# EAGLE design sl811hs (EAGLE 4.16)
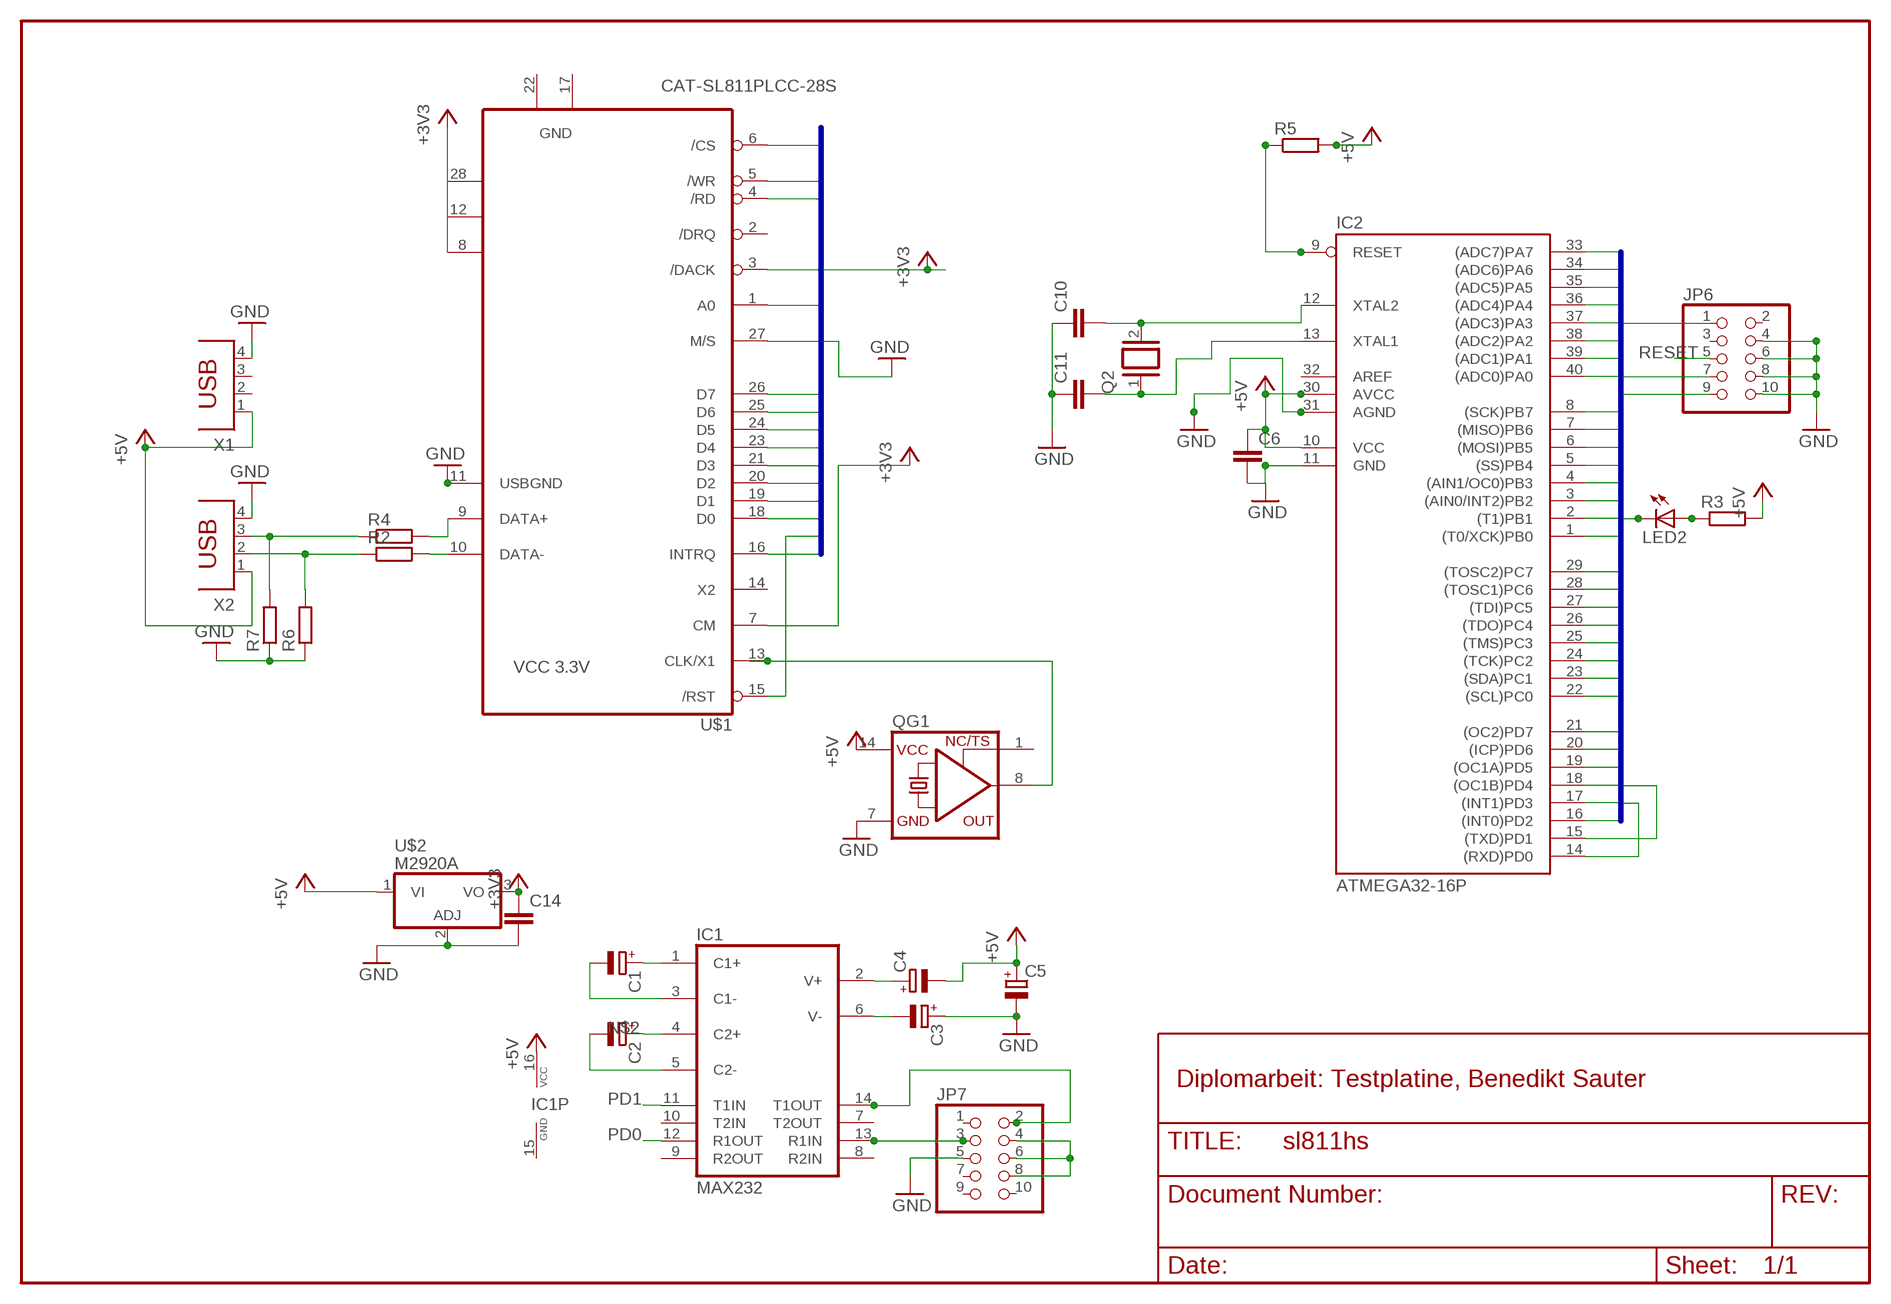
[diagram p0: schematic, sheet 1]

## Parts
C1  CPOL-EUE5-4  [E5-4]
C2  CPOL-EUE5-4  [E5-4]
C3  CPOL-EUE5-4  [E5-4]
C4  CPOL-EUE5-4  [E5-4]
C5  CPOL-EUE5-4  [E5-4]
C6  C-EU025-024X044  [C025-024X044]
C10  C-EU025-024X044  [C025-024X044]
C11  C-EU025-024X044  [C025-024X044]
C14  C-EU025-024X044  [C025-024X044]
IC1  MAX232  [DIL16]
IC2  ATMEGA32-16P  [DIL40]
JP6  PINHD-2X5  [2X05]
JP7  PINHD-2X5  [2X05]
LED2  LED3MM  [LED3MM]
Q2  XTAL/S  [QS]
QG1  XO-14  [DIL14S]
R2  R-EU_0204/7  [0204/7]
R3  R-EU_0204/7  [0204/7]
R4  R-EU_0204/7  [0204/7]
R5  R-EU_0204/7  [0204/7]
R6  R-EU_0204/7  [0204/7]
R7  R-EU_0204/7  [0204/7]
U$1  CAT-SL811PLCC-28S  [PLCC28S]
U$2  M2920A  [SOT233]
X1  PN61729  [PN61729]
X2  PN87520  [PN87520]

## Nets
+3V3: C14.1 U$1.3(/DACK) U$1.7(CM) U$1.8(VCC) U$2.3(VO)
+5V: C4.- C5.+ C6.1 IC1.16(VCC) IC2.10(VCC) IC2.30(AVCC) QG1.14(VCC) R3.2 R5.2 U$2.1(VI) X1.1 X2.1
GND: C3.+ C5.- C6.2 C10.1 C11.1 C14.2 IC2.11(GND) IC2.31(AGND) JP6.4 JP6.6 JP6.8 JP6.10 JP7.5 QG1.7(GND) R6.1 R7.1 U$1.11(USBGND) U$1.27(M/S) U$2.2(ADJ) X1.4 X2.4
N$1: C1.+ IC1.1(C1+)
N$2: C2.+ IC1.4(C2+)
N$3: C1.- IC1.3(C1-)
N$4: C2.- IC1.5(C2-)
N$5: C4.+ IC1.2(V+)
N$6: C3.- IC1.6(V-)
N$7: R2.1 R6.2 X2.2
N$8: QG1.8(OUT) U$1.13(CLK/X1)
N$9: C10.2 IC2.12(XTAL2) Q2.2
N$10: C11.2 IC2.13(XTAL1) Q2.1
N$12: R4.1 R7.2 X2.3
N$13: LED2.A R3.1
N$14: R4.2 U$1.9(DATA+)
N$15: R2.2 U$1.10(DATA-)
N$20: IC1.14(T1OUT) JP7.2
N$21: IC1.13(R1IN) JP7.3
N$22: JP7.4 JP7.6 JP7.8
PA0: IC2.40((ADC0)PA0) U$1.18(D0)
PA1: IC2.39((ADC1)PA1) U$1.19(D1)
PA2: IC2.38((ADC2)PA2) U$1.20(D2)
PA3: IC2.37((ADC3)PA3) U$1.21(D3)
PA4: IC2.36((ADC4)PA4) U$1.23(D4)
PA5: IC2.35((ADC5)PA5) U$1.24(D5)
PA6: IC2.34((ADC6)PA6) U$1.25(D6)
PA7: IC2.33((ADC7)PA7) U$1.26(D7)
PB0: IC2.1((T0/XCK)PB0)
PB1: IC2.2((T1)PB1) LED2.K(C)
PB2: IC2.3((AIN0/INT2)PB2)
PB3: IC2.4((AIN1/OC0)PB3)
PB4: IC2.5((SS)PB4)
PB5: IC2.6((MOSI)PB5) JP6.1
PB6: IC2.7((MISO)PB6) JP6.9
PB7: IC2.8((SCK)PB7) JP6.7
PC0: IC2.22((SCL)PC0)
PC1: IC2.23((SDA)PC1)
PC2: IC2.24((TCK)PC2)
PC3: IC2.25((TMS)PC3)
PC4: IC2.26((TDO)PC4)
PC5: IC2.27((TDI)PC5)
PC6: IC2.28((TOSC1)PC6)
PC7: IC2.29((TOSC2)PC7)
PD0: IC1.12(R1OUT) IC2.14((RXD)PD0)
PD1: IC1.11(T1IN) IC2.15((TXD)PD1)
PD2: IC2.16((INT0)PD2) U$1.16(INTRQ)
PD3: IC2.17((INT1)PD3) U$1.15(/RST)
PD4: IC2.18((OC1B)PD4) U$1.6(/CS)
PD5: IC2.19((OC1A)PD5) U$1.5(/WR)
PD6: IC2.20((ICP)PD6) U$1.4(/RD)
PD7: IC2.21((OC2)PD7) U$1.1(A0)
RESET: IC2.9(RESET) JP6.5 R5.1
Unconnected: IC1.7(T2OUT) IC1.8(R2IN) IC1.9(R2OUT) IC1.10(T2IN) JP6.2 JP6.3 JP7.1 JP7.7 JP7.9 JP7.10 QG1.1(TS) U$1.2(/DRQ) U$1.12(VCC) U$1.14(X2) U$1.28(VCC) X1.2 X1.3

## Buses
PD0,PD1,PD2,PD3,PD4,PD5,PD6,PD7,PC0,PC1,PC2,PC3,PC4,PC5,PC6,PC7,PB0,PB1,PB2,PB3,PB4,PB5,PB6,PB7,PA0,PA1,PA2,PA3,PA4,PA5,PA6,PA7

## Notes on the sheet
- Diplomarbeit: Testplatine, Benedikt Sauter

## Power pins joined to a net without a drawn wire
AREF: IC2.32(AREF)
GND: IC1.15(GND) U$1.17(GND) U$1.22(GND)

## Library data of the parts
C1-C5 = rcl:CPOL-EU: POLARIZED CAPACITOR, European symbol
C6 C10 C11 C14 = rcl:C-EU: CAPACITOR, European symbol
IC1 = maxim:MAX232: RS232 TRANSEIVER
IC2 = avr:ATMEGA32*P: MICROCONTROLLER 32 Kbytes FLASH 2 Kbytes SRAM 1 Kbytes EEPROM USART 8-channel 10 bit ADC
JP6 JP7 = pinhead:PINHD-2X5: PIN HEADER
LED2 = led:LED: LED OSRAM: - CHIPLED LG R971, LG N971, LY N971, LG Q971, LY Q971, LO R971, LY R971 LH N974, LH R974 LS Q976, LO Q976, LY Q976 LO Q996 - Hyper CHIPLED LW Q18S LB Q993, LB Q99A, LB R99A - SideLED LS A670, LO A670, LY A670, LG A670, LP A670 LB A673, LV A673, LT A673, LW A673 LH A674 LY A675 LS A676, LA A676, LO A676, LY A676, LW A676 LS A679, LY A679, LG A679 - Hyper Micro SIDELED® LS Y876, LA Y876, LO Y876, LY Y876 LT Y87S - SmartLED LW L88C, LW L88S LB L89C, LB L89S, LG L890 LS L89K, LO L89K, LY L89K LS L896, LA L896, LO L896, LY L896 - TOPLED LS T670, LO T670, LY T670, LG T670, LP T670 LSG T670, LSP T670, LSY T670, LOP T670, LYG T670 LG T671, LOG T671, LSG T671 LB T673, LV T673, LT T673, LW T673 LH T674 LS T676, LA T676, LO T676, LY T676, LB T676, LH T676, LSB T676, LW T676 LB T67C, LV T67C, LT T67C, LS T67K, LO T67K, LY T67K, LW E67C LS E67B, LA E67B, LO E67B, LY E67B, LB E67C, LV E67C, LT E67C LW T67C LS T679, LY T679, LG T679 LS T770, LO T770, LY T770, LG T770, LP T770 LB T773, LV T773, LT T773, LW T773 LH T774 LS E675, LA E675, LY E675, LS T675 LS T776, LA T776, LO T776, LY T776, LB T776 LHGB T686 LT T68C, LB T68C - Hyper Mini TOPLED® LB M676 - Mini TOPLED Santana® LG M470 LS M47K, LO M47K, LY M47K Source: http://www.osram.convergy.de - LUMILED® LXK2-PW12-R00, LXK2-PW12-S00, LXK2-PW14-U00, LXK2-PW14-V00 LXK2-PM12-R00, LXK2-PM12-S00, LXK2-PM14-U00 LXK2-PE12-Q00, LXK2-PE12-R00, LXK2-PE12-S00, LXK2-PE14-T00, LXK2-PE14-U00 LXK2-PB12-K00, LXK2-PB12-L00, LXK2-PB12-M00, LXK2-PB14-N00, LXK2-PB14-P00, LXK2-PB14-Q00 LXK2-PR12-L00, LXK2-PR12-M00, LXK2-PR14-Q00, LXK2-PR14-R00 LXK2-PD12-Q00, LXK2-PD12-R00, LXK2-PD12-S00 LXK2-PH12-R00, LXK2-PH12-S00 LXK2-PL12-P00, LXK2-PL12-Q00, LXK2-PL12-R00 Source: www.luxeon.com
Q2 = special:XTAL/S: CRYSTAL
QG1 = crystal:XO-: CRYSTAL
R2-R7 = rcl:R-EU_: RESISTOR, European symbol
U$1 = cat-sl811:CAT-SL811
U$2 = bene:M2920A
X1 = con-berg:PN61729: BERG USB connector
X2 = con-berg:PN87520: BERG USB connector

## Board
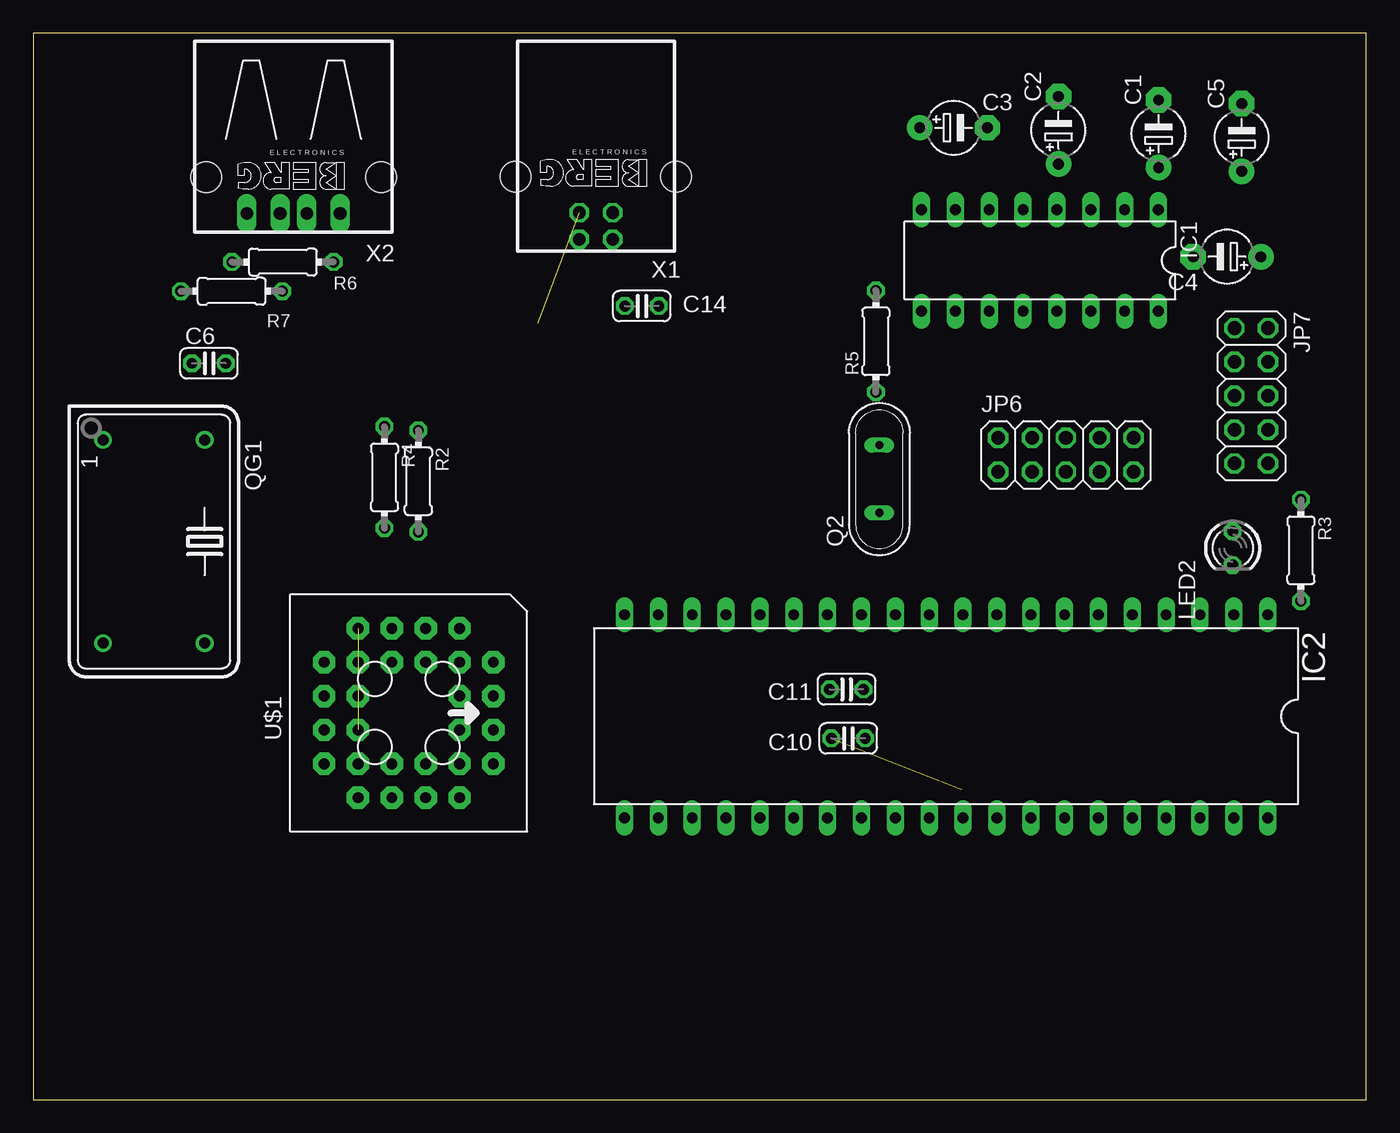
[diagram p1: board, top side]
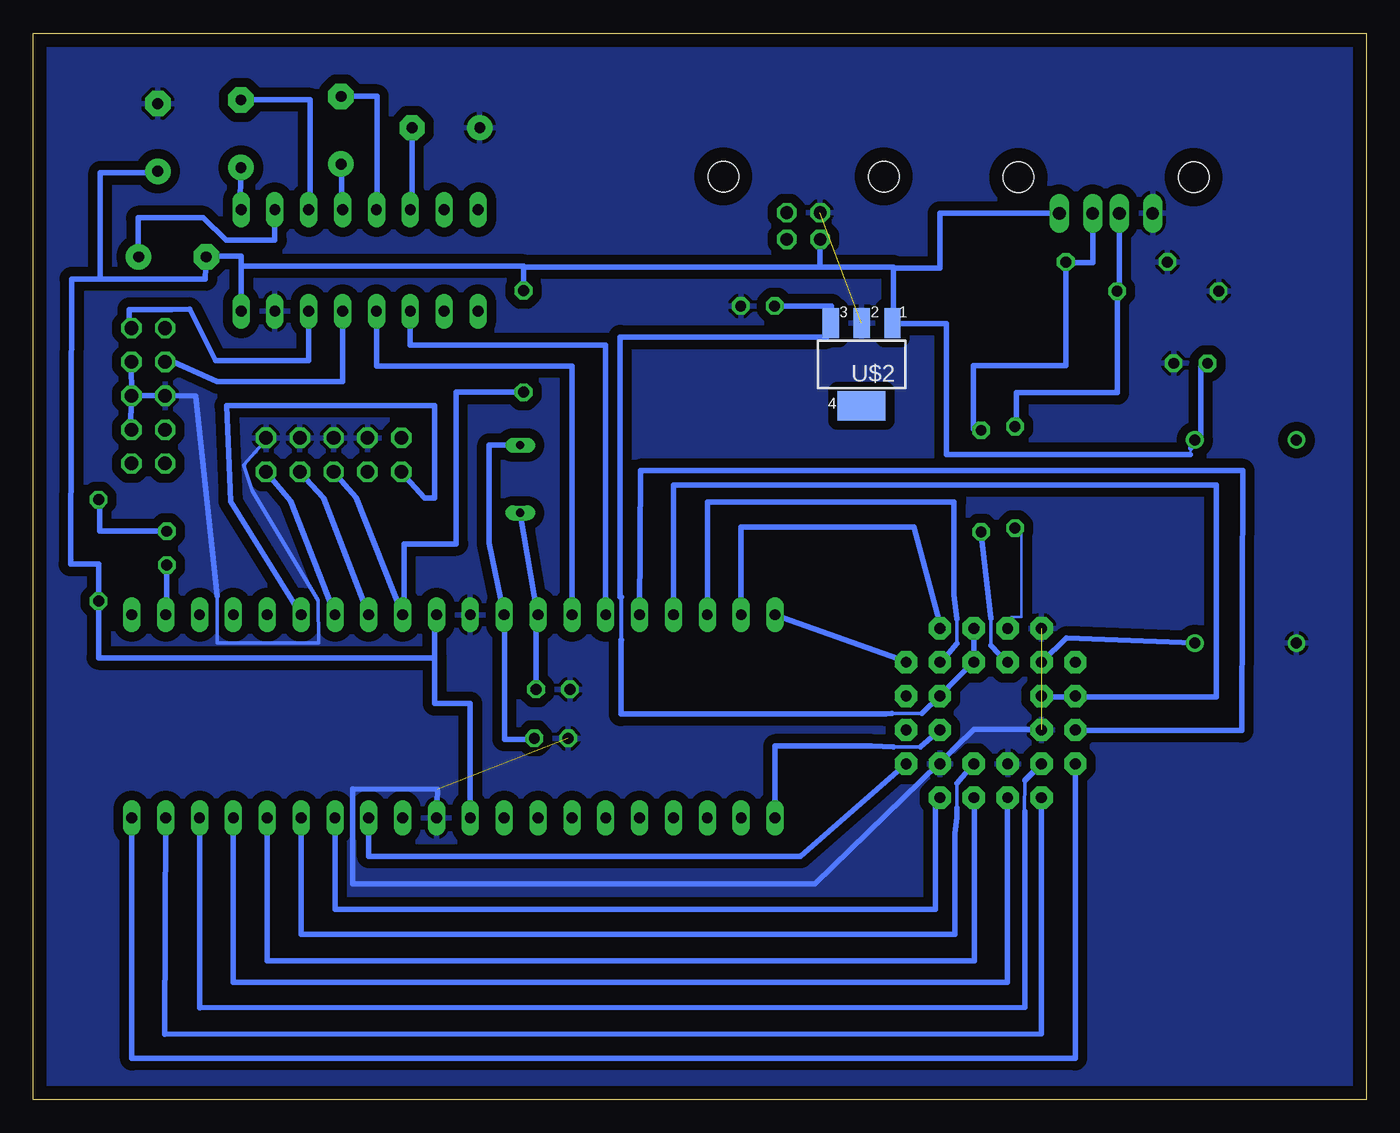
[diagram p2: board, bottom side, seen from below]

Size 100 x 80 mm. Coordinates in mm from the lower left corner, seen from the top.
Outline: 0,0 100,0 100,80 0,80 0,0
Copper layers (1*16): Top 0.035mm / dielectric 1.5mm / Bottom 0.035mm
Design rules "default": minimum track width 0.2mm, minimum drill 0.8mm, track to track 0.7mm, track to pad 0.7mm, pad to pad 0.7mm, via to via 0.7mm, smd to smd 0.7mm, copper to edge 40mil, drill to drill 8mil, minimum pad ring 10mil, minimum via ring 8mil, stop-mask expansion 4mil, vias tented up to drill 0mil, thermal gap 10mil

### Footprints (pad centres in the part's own frame; a part is rotated, then mirrored left to right if it is on the bottom)
E5-4 = drill 0.813 pad 1.905 round: + -2.54,0 | drill 0.813 pad 1.905 octagon: - 2.54,0
C025-024X044 = drill 0.813 octagon: 1 -1.27,0; 2 1.27,0
DIL16 = drill 0.813 long: 1 -8.89,-3.81; 2 -6.35,-3.81; 3 -3.81,-3.81; 4 -1.27,-3.81; 5 1.27,-3.81; 6 3.81,-3.81; 7 6.35,-3.81; 8 8.89,-3.81; 9 8.89,3.81; 10 6.35,3.81; 11 3.81,3.81; 12 1.27,3.81; 13 -1.27,3.81; 14 -3.81,3.81; 15 -6.35,3.81; 16 -8.89,3.81
DIL40 = drill 0.813 long: 1 -24.13,-7.62; 2 -21.59,-7.62; 3 -19.05,-7.62; 4 -16.51,-7.62; 5 -13.97,-7.62; 6 -11.43,-7.62; 7 -8.89,-7.62; 8 -6.35,-7.62; 9 -3.81,-7.62; 10 -1.27,-7.62; 11 1.27,-7.62; 12 3.81,-7.62; 13 6.35,-7.62; 14 8.89,-7.62; 15 11.43,-7.62; 16 13.97,-7.62; 17 16.51,-7.62; 18 19.05,-7.62; 19 21.59,-7.62; 20 24.13,-7.62; 21 24.13,7.62; 22 21.59,7.62; 23 19.05,7.62; 24 16.51,7.62; 25 13.97,7.62; 26 11.43,7.62; 27 8.89,7.62; 28 6.35,7.62; 29 3.81,7.62; 30 1.27,7.62; 31 -1.27,7.62; 32 -3.81,7.62; 33 -6.35,7.62; 34 -8.89,7.62; 35 -11.43,7.62; 36 -13.97,7.62; 37 -16.51,7.62; 38 -19.05,7.62; 39 -21.59,7.62; 40 -24.13,7.62
2X05 = drill 1.016 octagon: 1 -5.08,-1.27; 2 -5.08,1.27; 3 -2.54,-1.27; 4 -2.54,1.27; 5 0,-1.27; 6 0,1.27; 7 2.54,-1.27; 8 2.54,1.27; 9 5.08,-1.27; 10 5.08,1.27
LED3MM = drill 0.813 octagon: A -1.27,0; K 1.27,0
QS = drill 0.61 long: 1 -2.54,0; 2 2.54,0
DIL14S = drill 0.813 round: 1 -7.62,-3.81; 7 7.62,-3.81; 8 7.62,3.81; 14 -7.62,3.81
0204/7 = drill 0.813 octagon: 1 -3.81,0; 2 3.81,0
PLCC28S = drill 0.813 pad 1.676 octagon: 1 1.27,3.81; 2 3.81,6.35; 3 3.81,3.81; 4 6.35,6.35; 5 8.89,3.81; 6 6.35,3.81; 7 8.89,1.27; 8 6.35,1.27; 9 8.89,-1.27; 10 6.35,-1.27; 11 8.89,-3.81; 12 6.35,-6.35; 13 6.35,-3.81; 14 3.81,-6.35; 15 3.81,-3.81; 16 1.27,-6.35; 17 1.27,-3.81; 18 -1.27,-6.35; 19 -3.81,-3.81; 20 -1.27,-3.81; 21 -3.81,-1.27; 22 -1.27,-1.27; 23 -3.81,1.27; 24 -1.27,1.27; 25 -3.81,3.81; 26 -1.27,6.35; 27 -1.27,3.81; 28 1.27,6.35
SOT233 = smd 1.219 x 2.235: 1 -2.311,-3.099; 2 0,-3.099; 3 2.311,-3.099 | smd 3.6 x 2.2: 4 0,3.099
PN61729 = drill 0.95 octagon: 1 1.25,4.71; 2 -1.25,4.71; 3 -1.25,2.71; 4 1.25,2.71 | hole 2.3: -6.02,0; 6.02,0
PN87520 = drill 0.95 long: 1 -3.5,2.71; 2 -1,2.71; 3 1,2.71; 4 3.5,2.71 | hole 2.3: -6.57,0; 6.57,0

### Placement (x,y rotation side)
C1  84.43,72.46 90 top
C2  76.91,72.73 90 top
C3  69.04,72.92 0 top
C4  89.56,63.23 180 top
C5  90.66,72.19 90 top
C6  13.17,55.24 0 top
C10  61.14,27.1 0 top
C11  61.01,30.77 0 top
C14  45.65,59.54 0 top
IC1  75.53,62.96 180 top
IC2  68.48,28.75 180 top
JP6  77.47,48.37 0 top
JP7  91.38,52.8 270 top
LED2  89.98,41.37 270 top
Q2  63.47,46.56 90 top
QG1  9.04,41.87 270 top
R2  28.89,46.4 270 top
R3  95.1,41.2 270 top
R4  26.34,46.68 270 top
R5  63.22,56.89 90 top
R6  18.72,62.84 0 top
R7  14.88,60.65 0 top
U$1  28.17,26.46 90 bottom
U$2  37.86,55.16 180 bottom
X1  42.21,69.26 180 top
X2  19.52,69.21 180 top

### Tracks (layer width: path | path; a pad name or v marks a point on that pad's centre or on a via)
+3V3
  Bottom 0.254: 33.32,28.97 35.59,28.98
  Bottom 0.305: 55.85,34.49 55.85,37.7
  Bottom 0.406: U$1.7 29.43,35.46 U$1.8 29.43,32.92 U$1.3 33.32,28.97 | 55.85,37.7 55.98,37.7 55.98,57.21 40.47,57.21 U$2.3 40.11,58.26 40.11,59.54 C14.1 | 55.85,34.49 55.91,34.49 55.91,28.92 36.04,28.92 35.59,28.98
+5V
  Bottom 0.2: 13.17,48.89 13.21,48.39
  Bottom 0.406: IC2.30 67.21,29.71 69.89,29.71 69.89,33.14 | IC2.10 69.75,36.62 69.89,36.62 69.89,33.14 | C6.1 12.41,54.99 12.41,49.91 QG1.14 13.17,48.89 | 13.21,48.39 31.49,48.39 31.48,48.64 31.48,58.22 35.48,58.22 35.48,58.26 | 84.42,62.52 IC1.16 | 84.42,62.52 63.21,62.52 63.21,62.48 | R5.2 63.22,60.84 63.21,60.84 63.21,62.48 | 63.21,62.48 63.25,62.48 | 40.96,62.48 X1.1 | 40.96,62.48 63.21,62.48 | 35.48,58.26 U$2.1 | 40.96,62.48 35.48,62.48 35.48,62.39 | 35.48,58.26 35.48,62.39 | X2.1 31.99,66.5 31.99,62.39 35.48,62.39 | 35.48,62.39 35.52,62.39 | 69.89,33.14 95.1,33.14 R3.2 95.1,40.18 97.21,40.17 97.12,61.57 94.97,61.57 | 84.42,62.52 84.42,63.29 87.02,63.29 C4.- 87.1,61.57 94.97,61.57 | C5.+ 90.66,69.53 94.97,69.53 94.97,61.57 | 94.97,61.57 94.97,61.65
GND  (3 unrouted)
  Bottom 0.2: U$1.27 31.46,25.78 31.2,26.03 31.1,26.15
  Bottom 0.254: 86.21,37.79 86.21,34.26 78.58,34.26 78.62,37.43 83.6,45.7 84.23,47.61 82.5,49.55 JP6.10
  Bottom 0.406: U$1.17 24.36,27.75 29.45,27.75 41.36,16.19 76.05,16.19 76.05,23.31 69.69,23.26 69.74,21.34 IC2.31 | 92.67,50.26 92.64,52.83 JP7.5 87.84,52.76 86.21,37.79
  pour Bottom: 0.26,79.77 99.76,79.77 99.76,0.42 0.26,0.42 0.26,79.66
N$1
  Bottom 0.406: IC1.1 84.47,66.68 C1.+
N$2
  Bottom 0.406: IC1.4 76.84,66.83 C2.+
N$3
  Bottom 0.406: 79.22,66.77 79.22,66.73 | IC1.3 79.22,66.77 | C1.- 79.22,75 79.22,66.77
N$4
  Bottom 0.406: IC1.5 74.22,66.77 74.22,75.27 C2.-
N$5
  Bottom 0.406: IC1.2 81.88,64.48 85.52,64.48 87.27,66.16 92.14,66.16 92.14,63.23 | 92.14,63.23 92.14,63.18 | 92.14,63.23 C4.+
N$6
  Bottom 0.406: IC1.6 71.72,66.8 71.58,66.8 C3.-
N$7
  Bottom 0.2: R2.1 29.43,50.41
  Bottom 0.406: X2.2 20.52,62.81 22.53,62.81 R6.2 22.53,55.06 29.45,55.06 29.45,50.3 28.89,50.3 R2.1
N$8
  Bottom 0.406: QG1.8 22.48,34.62 24.28,32.85 U$1.13
N$9
  Bottom 0.406: Q2.2 65.79,49.1 65.79,41.76 64.7,36.49 IC2.12 64.66,36.37 64.66,27.03 62.37,27.03 62.37,27.1 | 62.37,27.1 62.37,27.13 | C10.2 62.37,27.1
N$10
  Bottom 0.406: 62.18,36.32 IC2.13 | 62.18,36.32 Q2.1 | 62.27,30.77 62.27,30.75 | C11.2 62.27,30.77 | 62.18,36.32 62.27,36.32 62.27,30.77
N$12
  Bottom 0.406: X2.3 18.52,60.76 18.69,60.76 R7.2 18.69,53.03 26.26,53.03 26.26,50.54 26.34,50.54 | 26.34,50.54 26.41,50.54 | 26.34,50.54 R4.1
N$13
  Bottom 0.406: 95.01,45.01 95.01,45.3 | 95.01,45.01 R3.1 | LED2.A 95.01,42.64 95.01,45.01
N$14
  Bottom 0.2: R4.2 25.87,42.54 25.87,36.19 26.63,36.19 U$1.9
N$15
  Bottom 0.254: 28.16,34.05 28.16,36.1
  Bottom 0.406: 28.16,36.1 R2.2 | U$1.10 26.95,32.8 28.16,34.05
N$20
  Bottom 0.406: IC1.14 79.34,55.46 86.33,55.46 88.27,59.3 89.62,59.27 92.8,59.27 92.82,58.22 JP7.2
N$21
  Bottom 0.406: IC1.13 76.79,53.85 86.2,53.85 90.22,55.67 JP7.3
N$22
  Bottom 0.406: JP7.4 92.61,52.69 JP7.6 92.67,50.11 JP7.8
PA0
  Bottom 0.406: IC2.40 92.61,3.08 21.82,3.08 21.82,25.24 U$1.18
PA1
  Bottom 0.406: IC2.39 90.13,4.9 24.36,4.93 24.38,22.61 24.36,22.61 | 24.36,22.61 24.21,22.61 | 24.36,22.61 U$1.19
PA2
  Bottom 0.254: 25.62,21.66 25.61,23.95
  Bottom 0.305: 25.62,21.61 25.62,21.66
  Bottom 0.406: IC2.38 87.53,6.88 25.62,6.91 25.62,19.24 25.62,21.61 | 25.61,23.95 U$1.20
PA3
  Bottom 0.406: IC2.37 84.99,8.81 26.93,8.81 26.93,22.44 26.9,22.44 | 26.9,22.44 26.79,22.44 | 26.9,22.44 U$1.21
PA4
  Bottom 0.406: IC2.36 82.45,10.4 29.4,10.4 29.4,22.81 | 29.4,22.81 29.44,22.81 U$1.23 | 29.4,22.81 29.26,22.81
PA5
  Bottom 0.254: 30.7,21.87 30.7,23.71
  Bottom 0.406: IC2.35 79.91,12.4 30.86,12.4 30.86,19.97 30.7,21.17 30.7,21.87 | U$1.24 29.45,25.19 30.7,23.71
PA6
  Bottom 0.406: IC2.34 77.37,14.25 32.31,14.25 32.31,22.37 31.98,22.37 | 31.98,22.37 31.87,22.37 | 31.98,22.37 U$1.25
PA7
  Bottom 0.406: IC2.33 74.83,18.25 42.44,18.25 34.56,25.13 34.52,25.13 | 34.52,25.13 34.27,25.13 | U$1.26 34.52,25.13
PB1
  Bottom 0.406: 90,40.1 90,40.35 | 90,40.1 LED2.K | IC2.2 90,36.37 90,40.1
PB5
  Bottom 0.406: IC2.6 85.19,44.87 85.5,52.06 69.91,52.06 69.91,45.12 70.65,45.12 JP6.1
PB6
  Bottom 0.406: JP6.9 80.69,44.92 IC2.7
PB7
  Bottom 0.406: JP6.7 78.22,45.12 IC2.8
PD0
  Bottom 0.406: IC1.12 74.26,55.02 59.59,55.02 IC2.14 | IC2.14 59.74,36.38 | IC2.14
PD1
  Bottom 0.406: IC1.11 71.72,56.6 57.09,56.6 57.09,36.33 | 57.09,36.33 57.05,36.33 IC2.15 | 57.09,36.33 57.19,36.33
PD2
  Bottom 0.406: IC2.16 54.44,47.18 9.27,47.18 9.34,27.68 21.82,27.68 U$1.16
PD3
  Bottom 0.406: IC2.17 51.98,46.1 11.24,46.1 11.23,30.22 24.36,30.22 U$1.15
PD4
  Bottom 0.254: 30.69,34.22 30.69,36.05
  Bottom 0.406: IC2.18 49.43,44.84 30.93,44.84 30.93,37.86 30.69,36.05 | U$1.6 31.89,32.84 30.69,34.22
PD5
  Bottom 0.406: IC2.19 46.89,42.97 33.92,42.97 31.92,35.4 U$1.5
PD6
  Bottom 0.406: U$1.4 34.52,32.86 IC2.20
PD7
  Bottom 0.254: 33.43,26.47 35.46,26.47
  Bottom 0.406: IC2.21 44.35,26.52 37.11,26.52 35.46,26.47 | U$1.1 32,27.7 33.43,26.47
RESET
  Bottom 0.406: JP6.5 75.8,45.18 IC2.9 72.2,36.37 | R5.1 68.27,53.08 68.27,41.69 72.2,41.69 72.2,36.37 | 72.2,36.12 72.2,36.37